# EAGLE design pot3elec (EAGLE 9.6.2)
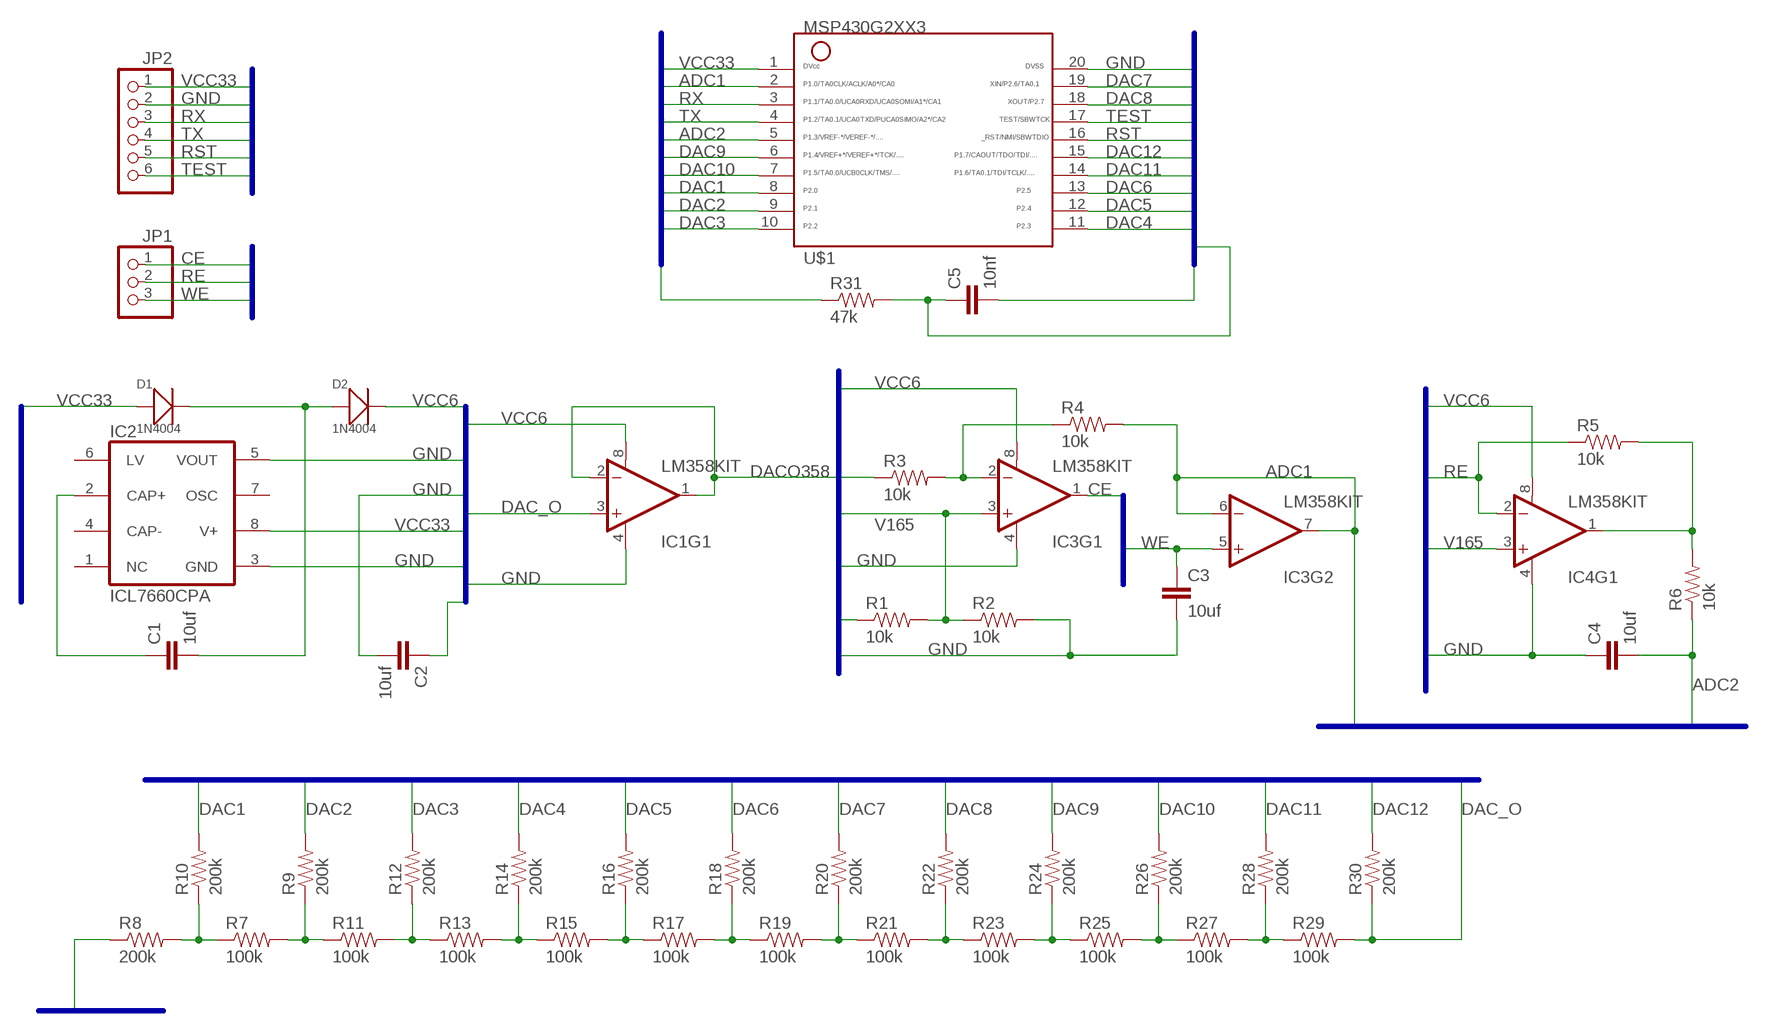
[diagram p0: schematic, sheet 1]

## Parts
C1  10uf  C2,5-3  [C2.5-3]
C2  10uf  C2,5-3  [C2.5-3]
C3  10uf  C2,5-3  [C2.5-3]
C4  10uf  C2,5-3  [C2.5-3]
C5  10nf  C2,5-3  [C2.5-3]
D1  1N4004  DIP-DIODE-400V-1A(DO-41)  [DO-41]
D2  1N4004  DIP-DIODE-400V-1A(DO-41)  [DO-41]
IC1  LM358KIT  [DIP08-KIT]
IC2  ICL7660CPA  [DIL08]
IC3  LM358KIT  [DIP08-KIT]
IC4  LM358KIT  [DIP08-KIT]
JP1  PINHD-1X3  [1X03]
JP2  PINHD-1X6  [1X06]
R1  10k  RESISTOR1206  [1206]
R2  10k  RESISTOR1206  [1206]
R3  10k  RESISTOR1206  [1206]
R4  10k  RESISTOR1206  [1206]
R5  10k  RESISTOR1206  [1206]
R6  10k  RESISTOR1206  [1206]
R7  100k  RESISTOR1206  [1206]
R8  200k  RESISTOR1206  [1206]
R9  200k  RESISTOR1206  [1206]
R10  200k  RESISTOR1206  [1206]
R11  100k  RESISTOR1206  [1206]
R12  200k  RESISTOR1206  [1206]
R13  100k  RESISTOR1206  [1206]
R14  200k  RESISTOR1206  [1206]
R15  100k  RESISTOR1206  [1206]
R16  200k  RESISTOR1206  [1206]
R17  100k  RESISTOR1206  [1206]
R18  200k  RESISTOR1206  [1206]
R19  100k  RESISTOR1206  [1206]
R20  200k  RESISTOR1206  [1206]
R21  100k  RESISTOR1206  [1206]
R22  200k  RESISTOR1206  [1206]
R23  100k  RESISTOR1206  [1206]
R24  200k  RESISTOR1206  [1206]
R25  100k  RESISTOR1206  [1206]
R26  200k  RESISTOR1206  [1206]
R27  100k  RESISTOR1206  [1206]
R28  200k  RESISTOR1206  [1206]
R29  100k  RESISTOR1206  [1206]
R30  200k  RESISTOR1206  [1206]
R31  47k  RESISTOR1206  [1206]
U$1  G2XX3---N20  [N20]

## Nets
ADC1: IC3.6(-IN) IC3.7(OUT) R4.2 U$1.2
ADC2: C4.2 R6.1 U$1.5
CE: IC3.1(OUT) JP1.1
DAC1: R10.2 U$1.8
DAC2: R9.2 U$1.9
DAC3: R12.2 U$1.10
DAC4: R14.2 U$1.11
DAC5: R16.2 U$1.12
DAC6: R18.2 U$1.13
DAC7: R20.2 U$1.19
DAC8: R22.2 U$1.18
DAC9: R24.2 U$1.6
DAC10: R26.2 U$1.7
DAC11: R28.2 U$1.14
DAC12: R30.2 U$1.15
DAC_O: IC1.3(+IN) R29.2 R30.1
DACO358: IC1.1(OUT) IC1.2(-IN) R3.1
GND: C2.2 C3.2 C4.1 C5.2 IC1.4(V-) IC2.3(GND) IC2.5(VOUT) IC3.4(V-) IC4.4(V-) JP2.2 R2.2 R8.1 U$1.20
N$1: C1.2 D1.2(-) D2.1(+)
N$2: C1.1 IC2.2(CAP+)
N$3: IC4.1(OUT) R5.2 R6.2
N$4: IC3.2(-IN) R3.2 R4.1
N$5: R7.1 R8.2 R10.1
N$6: R7.2 R9.1 R11.1
N$7: R11.2 R12.1 R13.1
N$8: R13.2 R14.1 R15.1
N$9: R15.2 R16.1 R17.1
N$10: R17.2 R18.1 R19.1
N$11: R19.2 R20.1 R21.1
N$12: R21.2 R22.1 R23.1
N$13: R23.2 R24.1 R25.1
N$14: R25.2 R26.1 R27.1
N$15: R27.2 R28.1 R29.1
RE: IC4.2(-IN) JP1.2 R5.1
RST: C5.1 JP2.5 R31.2 U$1.16
RX: JP2.3 U$1.3
TEST: JP2.6 U$1.17
TX: JP2.4 U$1.4
V165: IC3.3(+IN) IC4.3(+IN) R1.2 R2.1
VCC6: C2.1 D2.2(-) IC1.8(V+) IC3.8(V+) IC4.8(V+)
VCC33: D1.1(+) IC2.8(V+) JP2.1 R1.1 R31.1 U$1.1
WE: C3.1 IC3.5(+IN) JP1.3
Unconnected: IC1.5(+IN) IC1.6(-IN) IC1.7(OUT) IC2.1(NC) IC2.4(CAP-) IC2.6(LV) IC2.7(OSC) IC4.5(+IN) IC4.6(-IN) IC4.7(OUT)

## Buses
VCC33,GND,TX,RX,RST,TEST
CE,RE,WE
VCC33,GND,TX,RX,RST,TEST,DAC[1..12],ADC[1..2]
VCC33,GND,VCC6
VCC33,GND,VCC6,DAC_O
VCC33,GND,VCC6,V165,WE
ADC[1..2]
GND
DAC[1..12],DAC_O

## Library data of the parts
C1-C5 = capacitor-wima:C: CAPACITOR naming: grid - package width
D1 D2 = Seeed-Diode:DIP-DIODE-400V-1A(DO-41): 304010008; MPN: 1N4004
IC1 IC3 IC4 = SparkFun-AnalogIC:LM358: Jellybean op-amp; PROD_ID: IC-09172
IC2 = maxim:ICL7660CPA: VOLTAGE CONVERTER; MF: INTERSIL; MPN: ICL7660CPA; OC_FARNELL: 1018170; OC_NEWARK: 06F7441
JP1 = pinhead:PINHD-1X3: PIN HEADER
JP2 = pinhead:PINHD-1X6: PIN HEADER
R1-R31 = SparkFun-Passives:RESISTOR: Resistor Basic schematic elements and footprints for 0603, 1206, and PTH resistors.
U$1 = TI_MSP430_v16:G2XX3---N20: MSP430G2XX1 PDIP (N) 20 Pin Package

## Net classes
0 default: width 0 mm

## Board
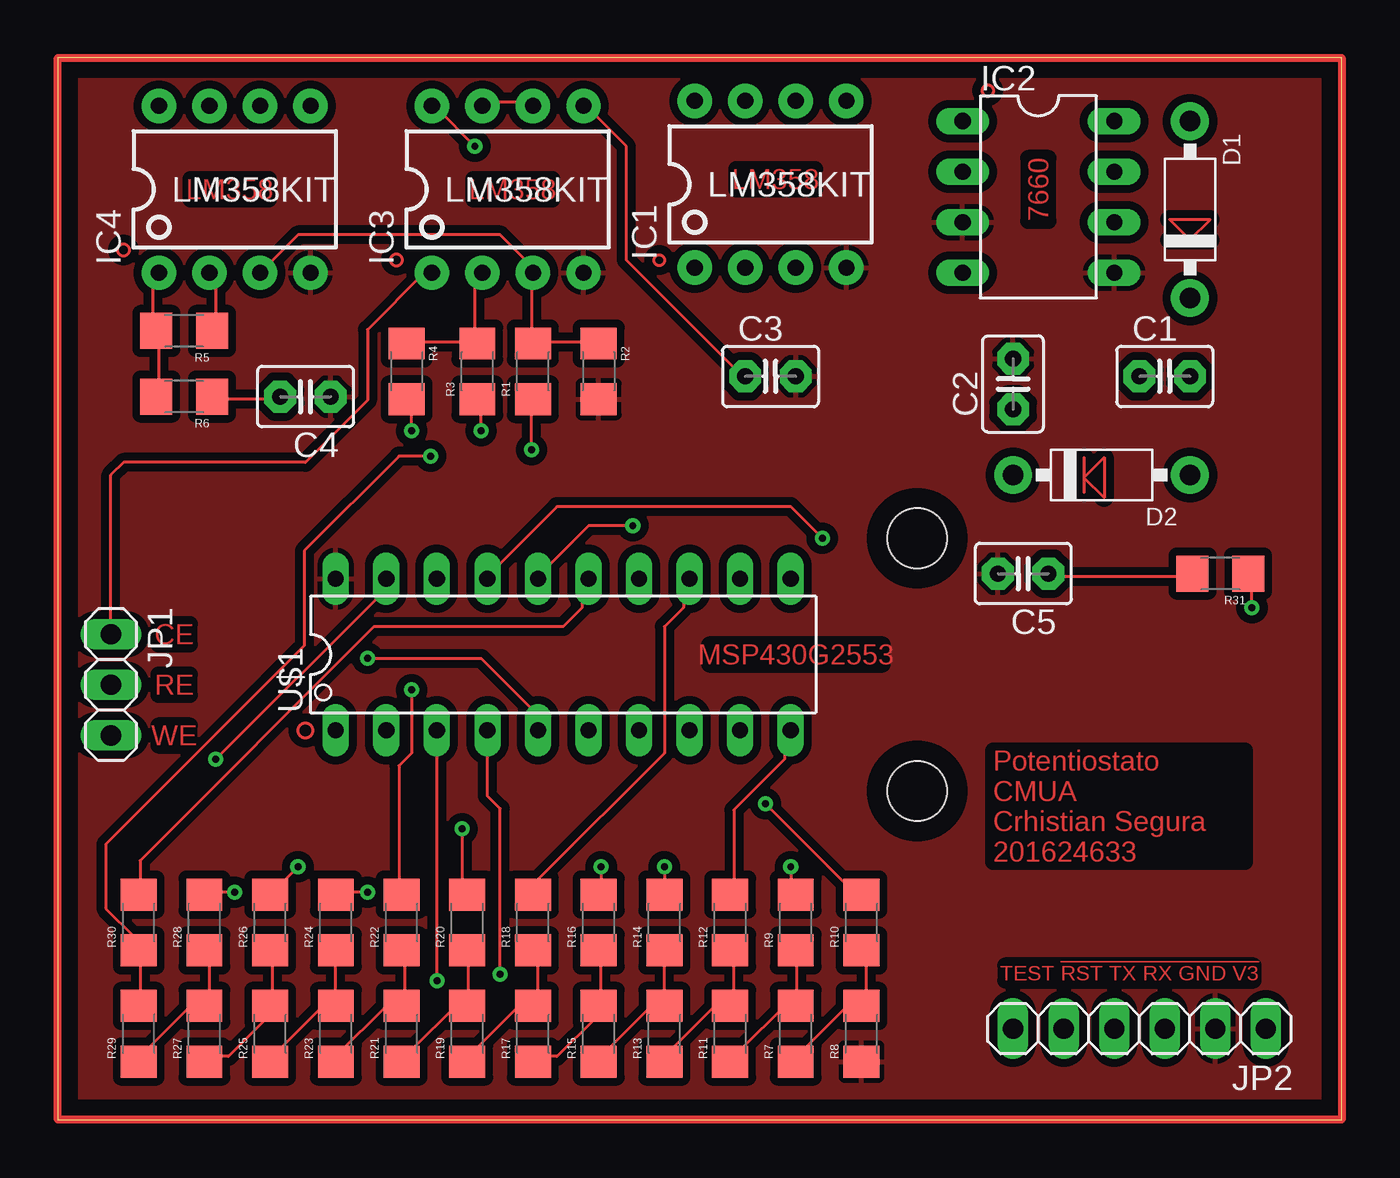
[diagram p1: board, top side]
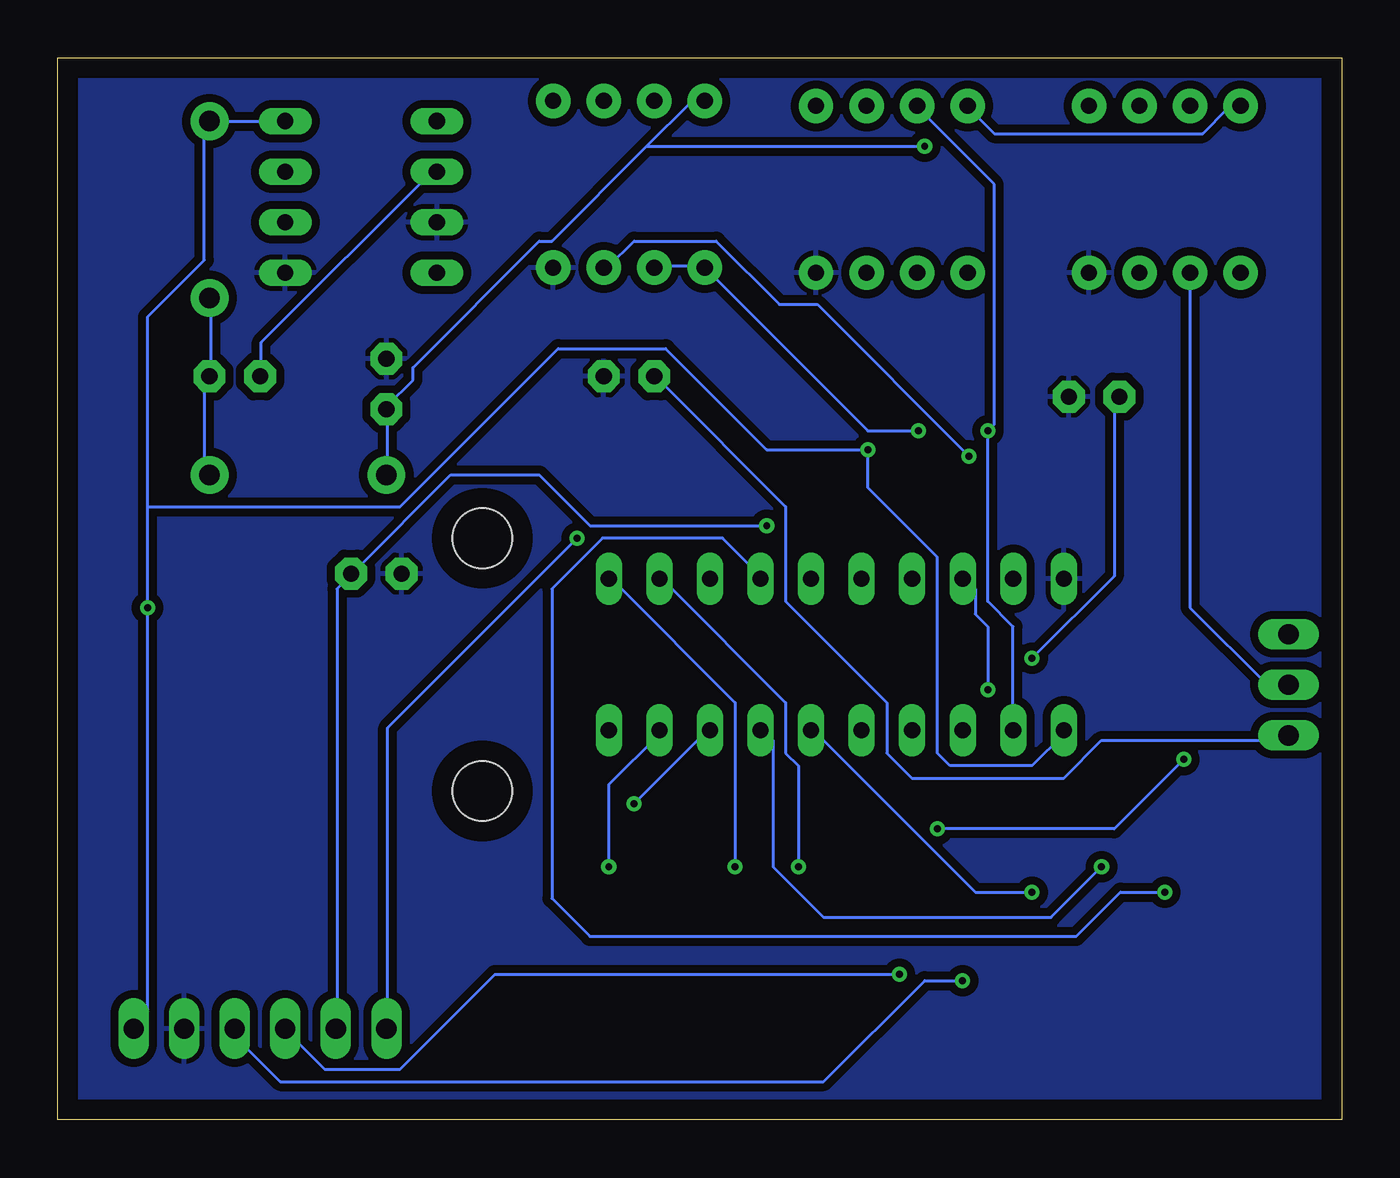
[diagram p2: board, bottom side, seen from below]

Size 64.52 x 53.34 mm. Coordinates in mm from the lower left corner, seen from the top.
Outline: 0,0 64.52,0 64.52,53.34 0,53.34 0,0
Copper layers (1*16): Top 0.035mm / dielectric 1.5mm / Bottom 0.035mm
Design rules "default *": minimum track width 6mil, minimum drill 0.35mm, track to track 15mil, track to pad 15mil, pad to pad 15mil, via to via 15mil, smd to smd 6mil, copper to edge 40mil, drill to drill 6mil, minimum pad ring 10mil, minimum via ring 8mil, stop-mask expansion 4mil, vias tented up to drill 0mil, thermal gap 10mil
Holes 3 mm at 43.18,16.51 43.18,29.21

### Footprints (pad centres in the part's own frame; a part is rotated, then mirrored left to right if it is on the bottom)
C2.5-3 = drill 0.813 pad 1.6 octagon: 1 -1.27,0; 2 1.27,0
DO-41 = drill 1.041 pad 1.905: 1 -4.445,0; 2 4.445,0
DIP08-KIT = drill 0.813 pad 1.727: 1 -3.81,-4.191; 2 -1.27,-4.191; 3 1.27,-4.191; 4 3.81,-4.191; 5 3.81,4.191; 6 1.27,4.191; 7 -1.27,4.191; 8 -3.81,4.191
DIL08 = drill 0.813 long: 1 -3.81,-3.81; 2 -1.27,-3.81; 3 1.27,-3.81; 4 3.81,-3.81; 5 3.81,3.81; 6 1.27,3.81; 7 -1.27,3.81; 8 -3.81,3.81
1X03 = drill 1.016 long: 1 -2.54,0; 2 0,0; 3 2.54,0
1X06 = drill 1.016 long: 1 -6.35,0; 2 -3.81,0; 3 -1.27,0; 4 1.27,0; 5 3.81,0; 6 6.35,0
1206 = smd 1.6 x 1.8: 1 -1.4,0; 2 1.4,0
N20 = drill 0.813 long: 1 -11.435,-3.81; 2 -8.895,-3.81; 3 -6.355,-3.81; 4 -3.815,-3.81; 5 -1.275,-3.81; 6 1.265,-3.81; 7 3.805,-3.81; 8 6.345,-3.81; 9 8.885,-3.81; 10 11.425,-3.81; 11 11.425,3.81; 12 8.885,3.81; 13 6.345,3.81; 14 3.805,3.81; 15 1.265,3.81; 16 -1.275,3.81; 17 -3.815,3.81; 18 -6.355,3.81; 19 -8.895,3.81; 20 -11.435,3.81

### Placement (x,y rotation side)
C1  55.63,37.34 0 top
C2  48.01,36.96 90 top
C3  35.81,37.34 0 top
C4  12.45,36.32 180 top
C5  48.51,27.43 180 top
D1  56.9,45.72 270 top
D2  52.45,32.38 180 top
IC1  35.81,46.99 0 top
IC2  49.28,46.35 270 top
IC3  22.61,46.74 0 top
IC4  8.89,46.74 0 top
JP1  2.67,21.84 270 top
JP2  54.36,4.57 180 top
R1  23.88,37.59 90 top
R2  27.18,37.59 270 top
R3  21.08,37.59 90 top
R4  17.53,37.59 270 top
R5  6.35,39.62 180 top
R6  6.35,36.32 180 top
R7  37.08,4.32 90 top
R8  40.39,4.32 90 top
R9  37.08,9.91 90 top
R10  40.39,9.91 90 top
R11  33.78,4.32 90 top
R12  33.78,9.91 90 top
R13  30.48,4.32 90 top
R14  30.48,9.91 90 top
R15  27.18,4.32 90 top
R16  27.18,9.91 90 top
R17  23.88,4.32 90 top
R18  23.88,9.91 90 top
R19  20.57,4.32 90 top
R20  20.57,9.91 90 top
R21  17.27,4.32 90 top
R22  17.27,9.91 90 top
R23  13.97,4.32 90 top
R24  13.97,9.91 90 top
R25  10.67,4.32 90 top
R26  10.67,9.91 90 top
R27  7.37,4.32 90 top
R28  7.37,9.91 90 top
R29  4.06,4.32 90 top
R30  4.06,9.91 90 top
R31  58.42,27.43 180 top
U$1  25.4,23.37 0 top

### Tracks (layer width: path | path; a pad name or v marks a point on that pad's centre or on a via)
ADC1  (via drill 0.35)
  Top 0.152: IC3.7 21.59,51.12 23.81,51.12 IC3.6 | v17.78,34.61 17.78,35.88 R4.2
  Bottom 0.152: U$1.2 16.51,19.68 16.51,24.77 17.78,26.04 v17.78,34.61 17.46,34.92 17.46,46.99 21.27,50.8 IC3.7
ADC2  (via drill 0.35)
  Top 0.152: R6.1 7.94,36.2 11.11,36.2 C4.2 | v15.56,23.18 21.27,23.18 23.81,20.64 23.81,19.68 U$1.5
  Bottom 0.152: v15.56,23.18 11.43,27.3 11.43,36.2 C4.2
CE
  Top 0.152: JP1.1 2.67,32.38 3.3,33.02 12.45,33.02 15.56,36.13 15.56,39.69 18.41,42.55 IC3.1
DAC1  (via drill 0.35)
  Top 0.152: v35.56,15.88 40.01,11.43 R10.2
  Bottom 0.152: v35.56,15.88 31.75,19.68 U$1.8
DAC2  (via drill 0.35)
  Top 0.152: v36.83,12.7 36.83,11.43 R9.2
  Bottom 0.152: v36.83,12.7 36.83,16.83 34.29,19.37 U$1.9
DAC3
  Top 0.152: R12.2 33.97,11.43 33.97,15.56 36.51,18.1 36.51,19.37 U$1.10
DAC4  (via drill 0.35)
  Top 0.152: v30.48,12.7 R14.2
  Bottom 0.152: v30.48,12.7 30.48,20.95 36.51,26.99 U$1.11
DAC5  (via drill 0.35)
  Top 0.152: v27.3,12.7 27.3,11.43 R16.2
  Bottom 0.152: v27.3,12.7 27.3,17.78 27.94,18.41 27.94,20.95 33.97,26.99 U$1.12
DAC6
  Top 0.152: R18.2 24.13,11.43 24.13,12.06 30.48,18.41 30.48,24.77 31.43,25.72 31.43,26.99 U$1.13
DAC7  (via drill 0.35)
  Top 0.152: v20.32,14.61 20.32,11.43 R20.2 | v7.94,18.1 16.19,26.35 16.19,26.99 U$1.19
  Bottom 0.152: v20.32,14.61 11.43,14.61 v7.94,18.1
DAC8  (via drill 0.35)
  Top 0.152: v17.78,21.59 17.78,18.41 17.14,17.78 17.14,11.43 R22.2
  Bottom 0.152: v17.78,21.59 17.78,24.77 18.41,25.4 18.41,26.67 U$1.18
DAC9  (via drill 0.35)
  Top 0.152: v15.56,11.43 13.97,11.43 R24.2
  Bottom 0.152: v15.56,11.43 18.41,11.43 26.35,19.37 U$1.6
DAC10  (via drill 0.35)
  Top 0.152: v12.06,12.7 10.79,11.43 R26.2
  Bottom 0.152: v12.06,12.7 14.61,10.16 26.04,10.16 28.57,12.7 28.57,19.05 U$1.7
DAC11  (via drill 0.35)
  Top 0.152: v8.89,11.43 7.62,11.43 R28.2
  Bottom 0.152: v8.89,11.43 11.11,11.43 13.34,9.21 37.78,9.21 39.69,11.11 39.69,26.67 37.15,29.21 31.11,29.21 29.21,27.3 U$1.14
DAC12
  Top 0.152: R30.2 4.13,11.43 4.13,13.02 15.88,24.77 25.4,24.77 26.35,25.72 26.35,26.99 U$1.15
DAC_O  (via drill 0.35)
  Top 0.152: R29.2 4.13,6.03 4.13,8.26 R30.1 3.81,8.57 3.81,9.21 2.41,10.6 2.41,13.84 12.38,23.81 12.38,28.57 17.14,33.34 v18.73,33.34
  Bottom 0.152: v18.73,33.34 26.35,40.96 28.26,40.96 31.43,44.13 35.56,44.13 36.83,42.86 IC1.3
DACO358  (via drill 0.35)
  Top 0.152: v21.27,34.61 21.27,35.88 R3.1
  Bottom 0.152: v21.27,34.61 23.81,34.61 IC1.1 32.07,42.86 34.29,42.86 IC1.2
GND
  pour Top (isolate 0.406): -2.54,0 -2.54,53.34 64.52,53.34 64.52,0
  pour Bottom (isolate 0.406): -1.27,0 -1.27,53.34 65.79,53.34 65.79,0
N$1
  Bottom 0.152: D1.2 56.83,41.27 56.83,37.47 C1.2 57.15,37.15 57.15,32.38 D2.1
N$2
  Bottom 0.152: IC2.2 45.72,47.62 54.29,39.05 54.29,37.47 C1.1
N$3
  Top 0.152: R6.2 5.08,36.51 5.08,39.37 R5.2 4.76,39.69 4.76,42.23 IC4.1
N$4
  Top 0.152: 20.95,39.05 17.78,39.05 R4.1 | 20.95,39.05 20.95,42.23 21.27,42.55 IC3.2 | 20.95,39.05 R3.2
N$5
  Top 0.152: R7.1 37.15,3.17 39.69,5.71 40.32,5.71 R8.2 40.64,6.03 40.64,8.26 R10.1
N$6
  Top 0.152: R11.1 33.97,3.17 36.83,6.03 R7.2 37.15,6.03 37.15,8.26 R9.1
N$7
  Top 0.152: R13.1 30.48,3.17 33.02,5.71 33.66,5.71 R11.2 33.97,6.03 33.97,8.26 R12.1
N$8
  Top 0.152: R15.1 27.3,3.17 29.84,5.71 R13.2 R14.1
N$9
  Top 0.152: R17.1 24.13,3.17 25.08,3.17 26.99,5.08 26.99,5.71 R15.2 27.3,6.03 27.3,8.26 R16.1
N$10
  Top 0.152: R19.1 20.64,3.17 23.18,5.71 23.81,5.71 R17.2 24.13,6.03 24.13,8.26 R18.1
N$11
  Top 0.152: R21.1 17.46,3.17 20.32,6.03 R19.2 20.64,6.03 20.64,8.26 R20.1
N$12
  Top 0.152: R23.1 13.97,3.17 16.51,5.71 17.14,5.71 R21.2 17.46,6.03 17.46,8.26 R22.1
N$13
  Top 0.152: R25.1 10.79,3.17 13.34,5.71 R23.2 R24.1
N$14
  Top 0.152: R27.1 7.62,3.17 8.57,3.17 10.48,5.08 10.48,5.71 R25.2 10.79,6.03 10.79,8.26 R26.1
N$15
  Top 0.152: R29.1 4.13,3.17 6.67,5.71 7.3,5.71 R27.2 7.62,6.03 7.62,8.26 R28.1
N$16
  Top 0.406: 0,0 0,53.34 64.52,53.34 64.52,0 0,0
N$17
  Top 0.152: 55.88,44.2 56.9,44.2 | 56.9,44.2 57.91,44.2 | 56.9,44.2 57.91,45.21 55.88,45.21 56.9,44.2
N$18
  Top 0.152: 51.56,33.27 51.56,32.26 | 51.56,32.26 51.56,31.5 | 51.56,32.26 52.58,33.27 52.58,31.24 51.56,32.26
RE
  Top 0.152: IC4.2 7.94,42.23 7.94,39.69 R5.1
  Bottom 0.152: IC4.2 7.62,25.72 3.75,21.84 JP1.2
RST  (via drill 0.35)
  Top 0.152: R31.2 56.83,27.3 49.85,27.3 C5.1 | v28.89,29.84 26.67,29.84 24.13,27.3 U$1.16
  Bottom 0.152: v28.89,29.84 37.78,29.84 40.32,32.38 44.77,32.38 49.53,27.62 C5.1 49.85,27.3 50.48,26.67 50.48,4.76 JP2.5
RX  (via drill 0.35)
  Top 0.152: v19.05,6.99 19.05,19.05 U$1.3
  Bottom 0.152: v19.05,6.99 20.95,6.99 26.04,1.91 53.34,1.91 55.88,4.45 JP2.3
TEST  (via drill 0.35)
  Top 0.152: v38.42,29.21 36.83,30.8 25.08,30.8 21.59,27.3 U$1.17
  Bottom 0.152: v38.42,29.21 47.94,19.68 47.94,4.76 JP2.6
TX  (via drill 0.35)
  Top 0.152: v22.23,7.3 22.23,15.62 21.59,16.26 21.59,19.37 U$1.4
  Bottom 0.152: v22.23,7.3 42.55,7.3 47.31,2.54 51.12,2.54 53.02,4.45 JP2.4
V165
  Top 0.152: R2.1 26.99,39.05 24.13,39.05 R1.2 23.81,39.05 23.81,42.55 IC3.3 24.13,42.55 22.23,44.45 12.06,44.45 IC4.3
VCC6  (via drill 0.35)
  Top 0.152: v20.95,48.9 19.05,50.8 IC3.8
  Bottom 0.152: IC4.8 5.08,50.8 5.71,50.8 6.99,49.53 17.46,49.53 18.73,50.8 IC3.8 | D2.2 47.94,32.38 47.94,35.56 C2.1 47.94,35.88 46.67,37.15 46.67,37.78 40.32,44.13 39.69,44.13 34.92,48.9 | 34.92,48.9 32.7,51.12 32.07,51.12 IC1.8 | 34.92,48.9 v20.95,48.9
VCC33  (via drill 0.35)
  Top 0.152: v23.81,33.66 23.81,35.88 R1.1 | v60.01,25.72 60.01,27.3 R31.1
  Bottom 0.152: U$1.1 13.97,19.37 15.56,17.78 19.68,17.78 20.32,18.41 20.32,28.26 23.81,31.75 v23.81,33.66 28.89,33.66 33.97,38.73 39.37,38.73 47.31,30.8 60.01,30.8 | IC2.8 D1.1 57.15,50.16 57.15,43.18 60.01,40.32 60.01,30.8 | JP2.1 60.64,4.76 60.01,5.4 v60.01,25.72 60.01,30.8
WE
  Top 0.152: IC3.5 26.67,50.8 28.57,48.9 28.57,43.18 34.29,37.47 C3.1
  Bottom 0.152: JP1.3 2.92,19.05 12.06,19.05 13.97,17.14 21.59,17.14 22.86,18.41 22.86,20.95 27.94,26.04 27.94,30.8 34.29,37.15 C3.1
(copper drawn outside any net)
  shapes: Top circle x5

### Text on the board
Top: LM358 | LM358 | LM358 | 7660 | CE | MSP430G2553 | RE | WE | Potentiostato / CMUA / Crhistian Segura / 201624633 | TEST !RST TX RX GND V3